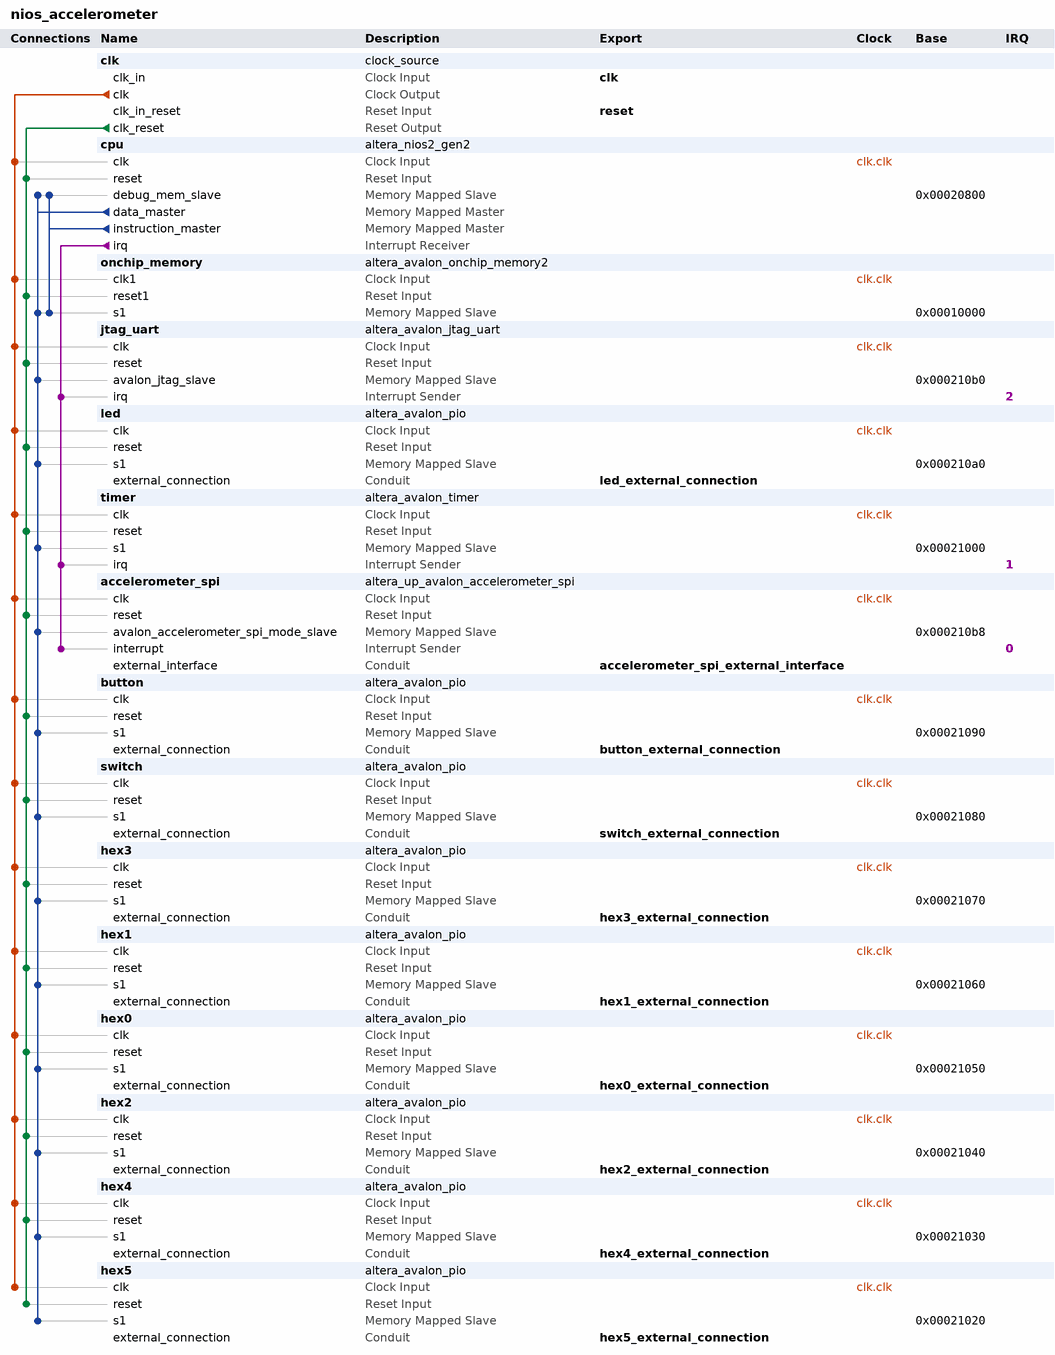
[diagram p0: system contents]
# Platform Designer (Qsys) system nios_accelerometer, MAX 10 10M50DAF484C7G
# Parameters at their usual value, and those the tool derives, are not listed.
package require -exact qsys 18.1
create_system nios_accelerometer
set_project_property DEVICE_FAMILY {MAX 10}
set_project_property DEVICE 10M50DAF484C7G

add_instance clk clock_source 18.1
set_instance_parameter_value clk clockFrequency 50000000

add_instance cpu altera_nios2_gen2 18.1
set_instance_parameter_value cpu dcache_size 2048
set_instance_parameter_value cpu exceptionSlave onchip_memory.s1
set_instance_parameter_value cpu icache_size 4096
set_instance_parameter_value cpu impl Tiny
set_instance_parameter_value cpu resetSlave onchip_memory.s1

add_instance onchip_memory altera_avalon_onchip_memory2 18.1
set_instance_parameter_value onchip_memory dataWidth 32
set_instance_parameter_value onchip_memory dualPort false
set_instance_parameter_value onchip_memory initMemContent false
set_instance_parameter_value onchip_memory initializationFileName onchip_mem.hex
set_instance_parameter_value onchip_memory memorySize 65536

add_instance jtag_uart altera_avalon_jtag_uart 18.1
set_instance_parameter_value jtag_uart simInteractiveOptions NO_INTERACTIVE_WINDOWS

add_instance led altera_avalon_pio 18.1
set_instance_parameter_value led direction Output
set_instance_parameter_value led width 10

add_instance timer altera_avalon_timer 18.1
set_instance_parameter_value timer period 1
set_instance_parameter_value timer periodUnits MSEC

add_instance accelerometer_spi altera_up_avalon_accelerometer_spi 18.0

add_instance button altera_avalon_pio 18.1
set_instance_parameter_value button direction Input
set_instance_parameter_value button width 4

add_instance switch altera_avalon_pio 18.1
set_instance_parameter_value switch direction Input
set_instance_parameter_value switch width 10

add_instance hex3 altera_avalon_pio 18.1
set_instance_parameter_value hex3 direction Output
set_instance_parameter_value hex3 width 7

add_instance hex1 altera_avalon_pio 18.1
set_instance_parameter_value hex1 direction Output
set_instance_parameter_value hex1 width 7

add_instance hex0 altera_avalon_pio 18.1
set_instance_parameter_value hex0 direction Output
set_instance_parameter_value hex0 width 7

add_instance hex2 altera_avalon_pio 18.1
set_instance_parameter_value hex2 direction Output
set_instance_parameter_value hex2 width 7

add_instance hex4 altera_avalon_pio 18.1
set_instance_parameter_value hex4 direction Output
set_instance_parameter_value hex4 width 7

add_instance hex5 altera_avalon_pio 18.1
set_instance_parameter_value hex5 direction Output
set_instance_parameter_value hex5 width 7

# connections
add_connection clk.clk accelerometer_spi.clk clock
add_connection clk.clk button.clk clock
add_connection clk.clk cpu.clk clock
add_connection clk.clk hex0.clk clock
add_connection clk.clk hex1.clk clock
add_connection clk.clk hex2.clk clock
add_connection clk.clk hex3.clk clock
add_connection clk.clk hex4.clk clock
add_connection clk.clk hex5.clk clock
add_connection clk.clk jtag_uart.clk clock
add_connection clk.clk led.clk clock
add_connection clk.clk onchip_memory.clk1 clock
add_connection clk.clk switch.clk clock
add_connection clk.clk timer.clk clock
add_connection clk.clk_reset accelerometer_spi.reset reset
add_connection clk.clk_reset button.reset reset
add_connection clk.clk_reset cpu.reset reset
add_connection clk.clk_reset hex0.reset reset
add_connection clk.clk_reset hex1.reset reset
add_connection clk.clk_reset hex2.reset reset
add_connection clk.clk_reset hex3.reset reset
add_connection clk.clk_reset hex4.reset reset
add_connection clk.clk_reset hex5.reset reset
add_connection clk.clk_reset jtag_uart.reset reset
add_connection clk.clk_reset led.reset reset
add_connection clk.clk_reset onchip_memory.reset1 reset
add_connection clk.clk_reset switch.reset reset
add_connection clk.clk_reset timer.reset reset
add_connection cpu.data_master accelerometer_spi.avalon_accelerometer_spi_mode_slave avalon
set_connection_parameter_value cpu.data_master/accelerometer_spi.avalon_accelerometer_spi_mode_slave baseAddress 0x000210b8
add_connection cpu.data_master button.s1 avalon
set_connection_parameter_value cpu.data_master/button.s1 baseAddress 0x00021090
add_connection cpu.data_master cpu.debug_mem_slave avalon
set_connection_parameter_value cpu.data_master/cpu.debug_mem_slave baseAddress 0x00020800
add_connection cpu.data_master hex0.s1 avalon
set_connection_parameter_value cpu.data_master/hex0.s1 baseAddress 0x00021050
add_connection cpu.data_master hex1.s1 avalon
set_connection_parameter_value cpu.data_master/hex1.s1 baseAddress 0x00021060
add_connection cpu.data_master hex2.s1 avalon
set_connection_parameter_value cpu.data_master/hex2.s1 baseAddress 0x00021040
add_connection cpu.data_master hex3.s1 avalon
set_connection_parameter_value cpu.data_master/hex3.s1 baseAddress 0x00021070
add_connection cpu.data_master hex4.s1 avalon
set_connection_parameter_value cpu.data_master/hex4.s1 baseAddress 0x00021030
add_connection cpu.data_master hex5.s1 avalon
set_connection_parameter_value cpu.data_master/hex5.s1 baseAddress 0x00021020
add_connection cpu.data_master jtag_uart.avalon_jtag_slave avalon
set_connection_parameter_value cpu.data_master/jtag_uart.avalon_jtag_slave baseAddress 0x000210b0
add_connection cpu.data_master led.s1 avalon
set_connection_parameter_value cpu.data_master/led.s1 baseAddress 0x000210a0
add_connection cpu.data_master onchip_memory.s1 avalon
set_connection_parameter_value cpu.data_master/onchip_memory.s1 baseAddress 0x00010000
add_connection cpu.data_master switch.s1 avalon
set_connection_parameter_value cpu.data_master/switch.s1 baseAddress 0x00021080
add_connection cpu.data_master timer.s1 avalon
set_connection_parameter_value cpu.data_master/timer.s1 baseAddress 0x00021000
add_connection cpu.instruction_master cpu.debug_mem_slave avalon
set_connection_parameter_value cpu.instruction_master/cpu.debug_mem_slave baseAddress 0x00020800
add_connection cpu.instruction_master onchip_memory.s1 avalon
set_connection_parameter_value cpu.instruction_master/onchip_memory.s1 baseAddress 0x00010000
add_connection cpu.irq accelerometer_spi.interrupt interrupt
set_connection_parameter_value cpu.irq/accelerometer_spi.interrupt irqNumber 0
add_connection cpu.irq jtag_uart.irq interrupt
set_connection_parameter_value cpu.irq/jtag_uart.irq irqNumber 2
add_connection cpu.irq timer.irq interrupt
set_connection_parameter_value cpu.irq/timer.irq irqNumber 1

# exported interfaces
add_interface accelerometer_spi_external_interface conduit end
set_interface_property accelerometer_spi_external_interface EXPORT_OF accelerometer_spi.external_interface
add_interface button_external_connection conduit end
set_interface_property button_external_connection EXPORT_OF button.external_connection
add_interface clk clock sink
set_interface_property clk EXPORT_OF clk.clk_in
add_interface hex0_external_connection conduit end
set_interface_property hex0_external_connection EXPORT_OF hex0.external_connection
add_interface hex1_external_connection conduit end
set_interface_property hex1_external_connection EXPORT_OF hex1.external_connection
add_interface hex2_external_connection conduit end
set_interface_property hex2_external_connection EXPORT_OF hex2.external_connection
add_interface hex3_external_connection conduit end
set_interface_property hex3_external_connection EXPORT_OF hex3.external_connection
add_interface hex4_external_connection conduit end
set_interface_property hex4_external_connection EXPORT_OF hex4.external_connection
add_interface hex5_external_connection conduit end
set_interface_property hex5_external_connection EXPORT_OF hex5.external_connection
add_interface led_external_connection conduit end
set_interface_property led_external_connection EXPORT_OF led.external_connection
add_interface reset reset sink
set_interface_property reset EXPORT_OF clk.clk_in_reset
add_interface switch_external_connection conduit end
set_interface_property switch_external_connection EXPORT_OF switch.external_connection

set_interconnect_requirement {$system} qsys_mm.clockCrossingAdapter HANDSHAKE
set_interconnect_requirement {$system} qsys_mm.enableEccProtection FALSE
set_interconnect_requirement {$system} qsys_mm.insertDefaultSlave FALSE
set_interconnect_requirement {$system} qsys_mm.maxAdditionalLatency 1

save_system nios_accelerometer.qsys
